# EAGLE schematic relay_pcb2 (EAGLE 7.2.0)
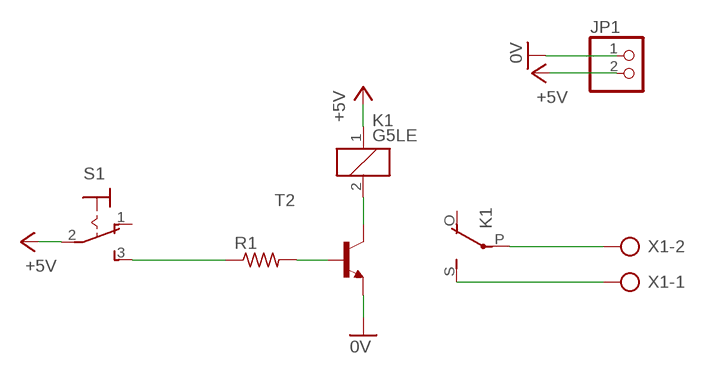
[diagram p0: schematic, sheet 1]

## Parts
JP1  PINHD-1X2  [1X02]
K1  G5LE  [G5LE]
R1  R-US_0207/10  [0207/10]
S1  M9040P  [M9040P]
T2  BC618-NPN-TO92-CBE  [TO92-CBE]
X1  AK500/2  [AK500/2]

## Nets
0V: JP1.1 T2.E
+5V: JP1.2 K1.1 S1.2(P)
N$1: R1.2 T2.B
N$2: K1.2 T2.C
N$3: R1.1 S1.3(S)
N$4: K1.P(2:P) X1.2
N$5: K1.S(2:S) X1.1
Unconnected: K1.O(2:O) S1.1(O)

## Library data of the parts
JP1 = pinhead:PINHD-1X2: PIN HEADER
K1 = relay:G5LE: RELAY 1 x switch, 10 A/120 V AC, 8 A/30 V DC, Omron; OC_FARNELL: unknown; OC_NEWARK: unknown
R1 = rcl:R-US_: RESISTOR, American symbol
S1 = switch:M9040P: TOGGLE SWITCH Marquardt
T2 = transistor:*-NPN-: NPN Transistror BF959 corrected 2008.03.06
X1 = con-ptr500:AK500/2: CONNECTOR; OC_FARNELL: unknown; OC_NEWARK: unknown